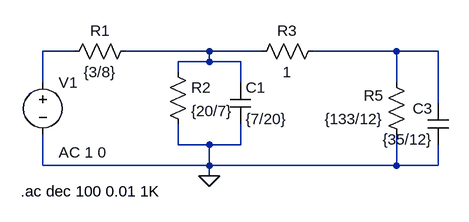
[diagram p0: schematic Draft1.asc]
Draft1.asc, the LTspice schematic file:
Version 4
SHEET 1 880 680
WIRE 80 128 32 128
WIRE 288 128 160 128
WIRE 368 128 288 128
WIRE 576 128 448 128
WIRE 640 128 576 128
WIRE 288 144 288 128
WIRE 288 144 240 144
WIRE 336 144 288 144
WIRE 240 160 240 144
WIRE 32 176 32 128
WIRE 336 176 336 144
WIRE 576 176 576 128
WIRE 640 208 640 128
WIRE 240 272 240 240
WIRE 288 272 240 272
WIRE 336 272 336 240
WIRE 336 272 288 272
WIRE 32 304 32 256
WIRE 288 304 288 272
WIRE 288 304 32 304
WIRE 576 304 576 256
WIRE 576 304 288 304
WIRE 640 304 640 272
WIRE 640 304 576 304
WIRE 288 320 288 304
FLAG 288 320 0
SYMBOL res 176 112 R90
WINDOW 0 0 56 VBottom 2
WINDOW 3 32 56 VTop 2
SYMATTR InstName R1
SYMATTR Value {3/8}
SYMBOL res 224 144 R0
SYMATTR InstName R2
SYMATTR Value {20/7}
SYMBOL cap 320 176 R0
SYMATTR InstName C1
SYMATTR Value {7/20}
SYMBOL voltage 32 160 R0
WINDOW 123 24 124 Left 2
WINDOW 39 0 0 Left 0
SYMATTR InstName V1
SYMATTR Value ""
SYMATTR Value2 AC 1 0
SYMBOL res 592 272 R180
WINDOW 0 36 76 Left 2
WINDOW 3 36 40 Left 2
SYMATTR InstName R5
SYMATTR Value {133/12}
SYMBOL cap 656 272 R180
WINDOW 0 24 56 Left 2
WINDOW 3 24 8 Left 2
SYMATTR InstName C3
SYMATTR Value {35/12}
SYMBOL res 464 112 R90
WINDOW 0 0 56 VBottom 2
WINDOW 3 32 56 VTop 2
SYMATTR InstName R3
SYMATTR Value 1
TEXT -2 344 Left 2 !.ac dec 100 0.01 1K

The netlist it stands for:
* Draft1.asc
R1 N002 N001 {3/8}
R2 N002 0 {20/7}
C1 N002 0 {7/20}
V1 N001 0 AC 1 0
R5 0 N003 {133/12}
C3 0 N003 {35/12}
R3 N003 N002 1
.ac dec 100 0.01 1K
.backanno
.end